# Altium project BLDC_Prototype.PrjPCB
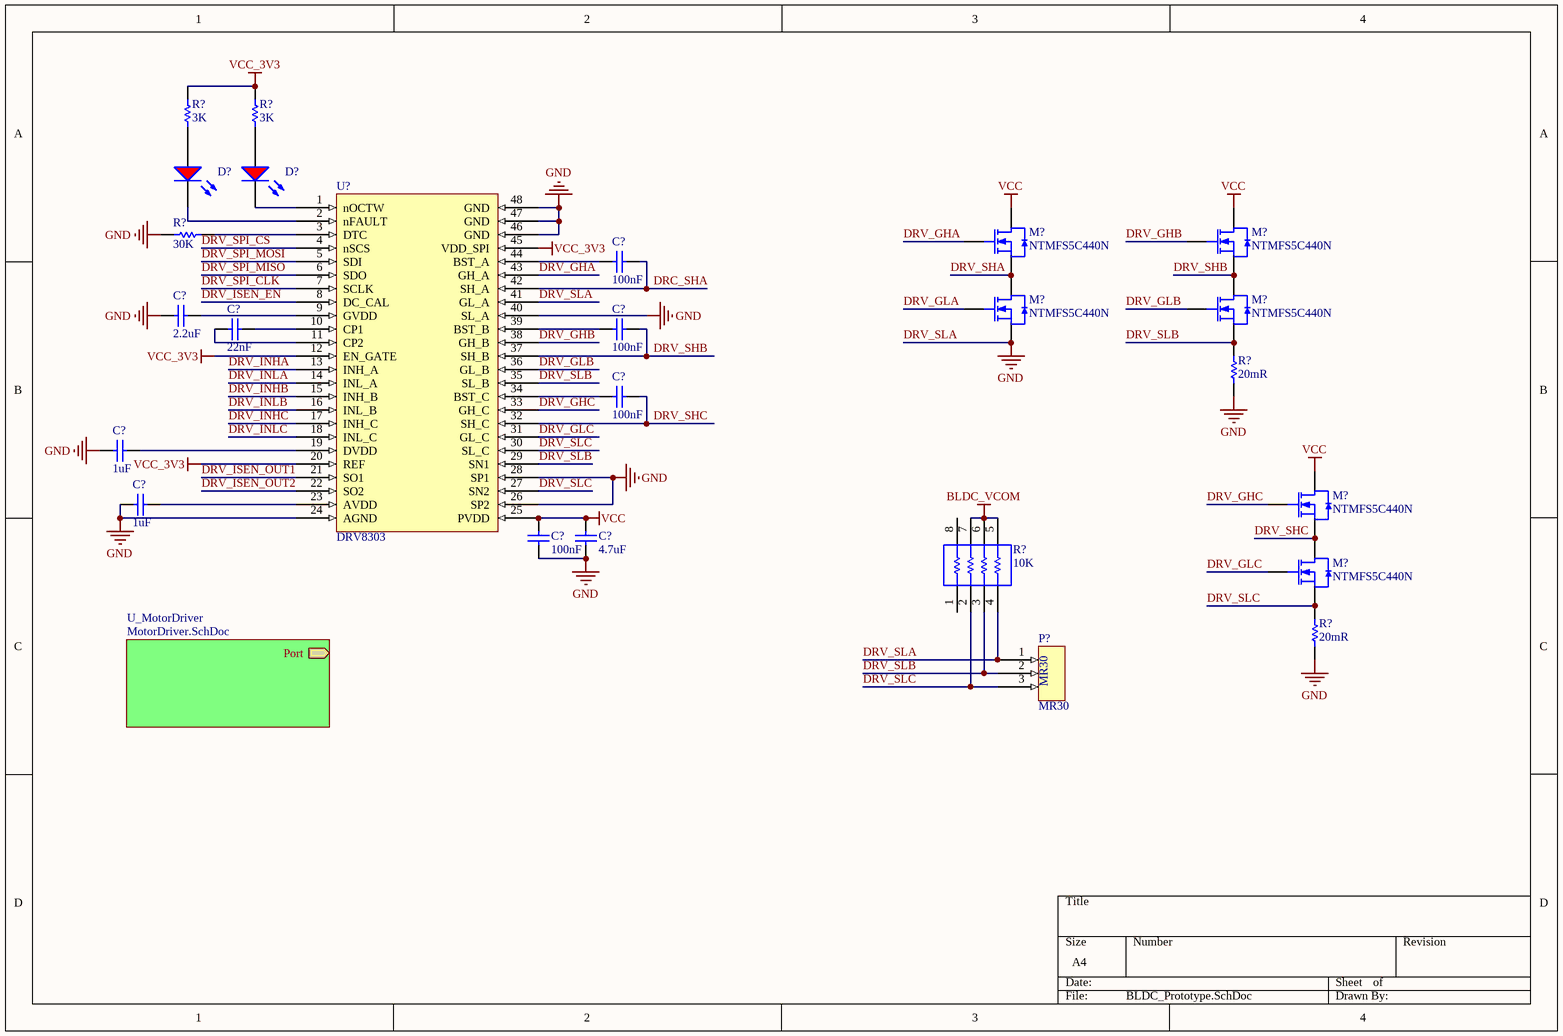
[diagram p0: BLDC_Prototype.SchDoc]
4 sheets, 79 parts. Net scope: hierarchical (ports join the sheet entries above them; power ports are global).
Board file: BLDC_Prototype.PcbDoc
Sheets:
  BLDC_Prototype.SchDoc
    U_MotorDriver = MotorDriver.SchDoc
  MCU.SchDoc
  MOSFET.SchDoc

## Sheet BLDC_Prototype.SchDoc
size A4

### Parts
(Parts that share a designator on the sheet are numbered #1, #2 ... from top to bottom, then left to right.)
C?#1  100nF  [SMC_0805]
C?#2  2.2uF  [SMC_0805]
C?#3  22nF  [SMC_0805]
C?#4  100nF  [SMC_0805]
C?#5  100nF  [SMC_0805]
C?#6  1uF  [SMC_0805]
C?#7  1uF  [SMC_0805]
C?#8  100nF  [SMC_0805]
C?#9  4.7uF  [SMC_0805]
D?#1  (no value)  [SMLED_0603]
D?#2  (no value)  [SMLED_0603]
M?#1  NTMFS5C440N  [PSON127P620X100-8N]
M?#2  NTMFS5C440N  [PSON127P620X100-8N]
M?#3  NTMFS5C440N  [PSON127P620X100-8N]
M?#4  NTMFS5C440N  [PSON127P620X100-8N]
M?#5  NTMFS5C440N  [PSON127P620X100-8N]
M?#6  NTMFS5C440N  [PSON127P620X100-8N]
P?  MR30  [MR30PW-FB]
R?#1  3K  [SMR_0805]
R?#2  3K  [SMR_0805]
R?#3  30K  [SMR_0805]
R?#4  20mR  [SMR_2512]
R?#5  10K  [SMR_0402x4]
R?#6  20mR  [SMR_2512]
U?#1  DRV8303  [TSSOP50P810X120_HS-49L]

### Sub-sheets
U_MotorDriver = MotorDriver.SchDoc: Port (out)

### Nets
BLDC_VCOM: R?#5.5 R?#5.6 R?#5.7
DRV_SLA: C?#2.1 C?#6.1 C?#7.1 C?#8.1 C?#9.1 M?#3.S P?.1 R?#3.1 R?#4.1 R?#5.4 R?#6.1 U?#1.24(AGND) U?#1.26(SP2) U?#1.28(SP1) U?#1.40(SL_A) U?#1.41(GL_A) U?#1.46(GND) U?#1.47(GND) U?#1.48(GND)  [also labelled GND]
VCC: C?#8.2 C?#9.2 M?#1.D M?#2.D M?#5.D U?#1.25(PVDD)
VCC_3V3: R?#1.1 R?#2.1 U?#1.12(EN_GATE) U?#1.20(REF) U?#1.45(VDD_SPI)
DRC_SHA: C?#1.2 U?#1.42(SH_A)
DRV_GHA: M?#1.G U?#1.43(GH_A)
DRV_GHB: M?#2.G U?#1.38(GH_B)
DRV_GHC: M?#5.G U?#1.33(GH_C)
DRV_GLA: M?#3.G
DRV_GLB: M?#4.G U?#1.36(GL_B)
DRV_GLC: M?#6.G U?#1.31(GL_C)
DRV_INHA: U?#1.13(INH_A)
DRV_INHB: U?#1.15(INH_B)
DRV_INHC: U?#1.17(INH_C)
DRV_INLA: U?#1.14(INL_A)
DRV_INLB: U?#1.16(INL_B)
DRV_INLC: U?#1.18(INL_C)
DRV_ISEN_EN: U?#1.8(DC_CAL)
DRV_ISEN_OUT1: U?#1.21(SO1)
DRV_ISEN_OUT2: U?#1.22(SO2)
DRV_SHA: M?#1.S M?#3.D
DRV_SHB: C?#4.2 M?#2.S M?#4.D U?#1.37(SH_B)
DRV_SHC: C?#5.2 M?#5.S M?#6.D U?#1.32(SH_C)
DRV_SLB: M?#4.S P?.2 R?#4.2 R?#5.3 U?#1.29(SN1) U?#1.35(SL_B)
DRV_SLC: M?#6.S P?.3 R?#5.2 R?#6.2 U?#1.27(SN2) U?#1.30(SL_C)
DRV_SPI_CLK: U?#1.7(SCLK)
DRV_SPI_CS: U?#1.4(nSCS)
DRV_SPI_MISO: U?#1.6(SDO)
DRV_SPI_MOSI: U?#1.5(SDI)
NetC?#1_1: C?#1.1 U?#1.44(BST_A)
NetC?#2_2: C?#2.2 U?#1.9(GVDD)
NetC?#3_1: C?#3.1 U?#1.11(CP2)
NetC?#3_2: C?#3.2 U?#1.10(CP1)
NetC?#4_1: C?#4.1 U?#1.39(BST_B)
NetC?#5_1: C?#5.1 U?#1.34(BST_C)
NetC?#6_2: C?#6.2 U?#1.19(DVDD)
NetC?#7_2: C?#7.2 U?#1.23(AVDD)
NetD?#1_A: D?#1.A R?#1.2
NetD?#1_K: D?#1.K U?#1.2(nFAULT)
NetD?#2_A: D?#2.A R?#2.2
NetD?#2_K: D?#2.K U?#1.1(nOCTW)
NetR?#3_2: R?#3.2 U?#1.3(DTC)

Not connected (* = marked no-connect by the designer): R?#5 1 8

### Library data of the parts
C?#1-C?#9 = Cap Ceramic
D?#1 D?#2 = LED_Red
R?#1-R?#4 R?#6 = Res SMT
R?#5 = Res Array x 4

## Sheet MotorDriver.SchDoc
size A4
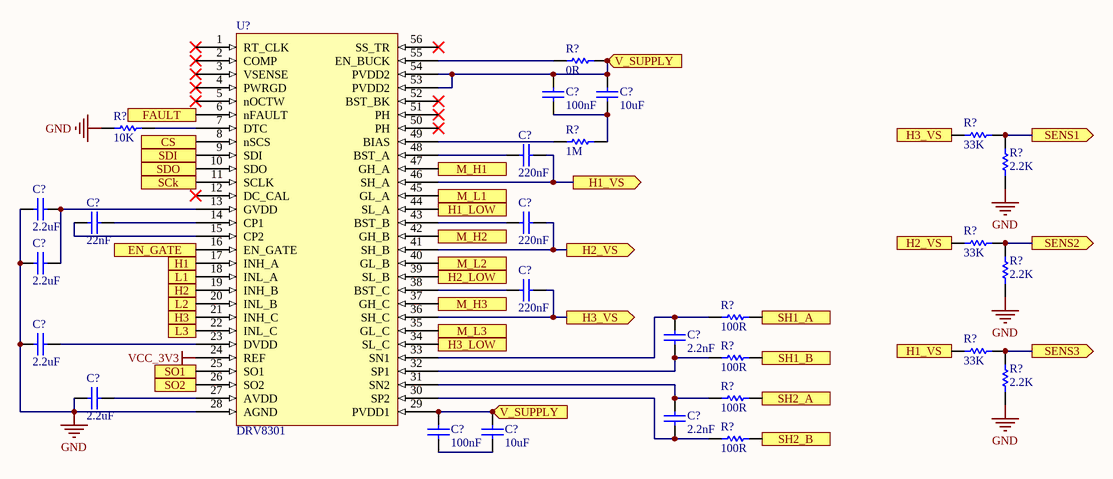
[diagram p1: MotorDriver.SchDoc]

### Parts
(Parts that share a designator on the sheet are numbered #1, #2 ... from top to bottom, then left to right.)
C?#10  100nF  [SMC_0805]
C?#11  10uF  [SMC_0805]
C?#12  220nF  [SMC_0805]
C?#13  2.2uF  [SMC_0805]
C?#14  22nF  [SMC_0805]
C?#15  220nF  [SMC_0805]
C?#16  2.2uF  [SMC_0805]
C?#17  220nF  [SMC_0805]
C?#18  2.2uF  [SMC_0805]
C?#19  2.2nF  [SMC_0402]
C?#20  2.2uF  [SMC_0805]
C?#21  2.2nF  [SMC_0402]
C?#22  100nF  [SMC_0805]
C?#23  10uF  [SMC_0805]
R?#7  0R  [SMR_0402]
R?#8  10K  [SMR_0402]
R?#9  33K  [SMR_0402]
R?#10  1M  [SMR_0402]
R?#11  2.2K  [SMR_0402]
R?#12  33K  [SMR_0402]
R?#13  2.2K  [SMR_0402]
R?#14  100R  [SMR_0402]
R?#15  33K  [SMR_0402]
R?#16  100R  [SMR_0402]
R?#17  100R  [SMR_0402]
R?#18  2.2K  [SMR_0402]
R?#19  100R  [SMR_0402]
U?#2  DRV8301  [TSSOP50P810X120_HS-57N]

### Ports
CS (in), EN_GATE (in), FAULT (out), H1 (in), H1_LOW (out), H1_VS (in), H1_VS (out), H2 (in), H2_LOW (out), H2_VS (in), H2_VS (out), H3 (in), H3_LOW (out), H3_VS (in), H3_VS (out), L1 (in), L2 (in), L3 (in), M_H1 (out), M_H2 (out), M_H3 (out), M_L1 (out), M_L2 (out), M_L3 (out), SCk (in), SDI (in), SDO (out), SENS1 (out), SENS2 (out), SENS3 (out), SH1_A (in), SH1_B (in), SH2_A (in), SH2_B (in), SO1 (out), SO2 (out), V_SUPPLY (in)

### Nets
GND: C?#13.2 C?#16.2 C?#18.2 C?#20.2 R?#8.1 R?#11.1 R?#13.1 R?#18.1 U?#2.28(AGND)  [project net DRV_SLA]
VCC_3V3: U?#2.24(REF)
NetC?#10_1: C?#10.1 C?#11.1 R?#10.2
NetC?#10_2: C?#10.2 C?#11.2 C?#22.2 C?#23.2 R?#7.2 U?#2.29(PVDD1) U?#2.53(PVDD2) U?#2.54(PVDD2) ; port V_SUPPLY
NetC?#12_1: C?#12.1 U?#2.48(BST_A)
NetC?#12_2: C?#12.2 R?#15.1 U?#2.46(SH_A) ; port H1_VS
NetC?#13_1: C?#13.1 C?#16.1 U?#2.13(GVDD)
NetC?#14_1: C?#14.1 U?#2.14(CP1)
NetC?#14_2: C?#14.2 U?#2.15(CP2)
NetC?#15_1: C?#15.1 U?#2.43(BST_B)
NetC?#15_2: C?#15.2 R?#12.1 U?#2.41(SH_B) ; port H2_VS
NetC?#17_1: C?#17.1 U?#2.38(BST_C)
NetC?#17_2: C?#17.2 R?#9.1 U?#2.36(SH_C) ; port H3_VS
NetC?#18_1: C?#18.1 U?#2.23(DVDD)
NetC?#19_1: C?#19.1 R?#16.1 U?#2.32(SP1)
NetC?#19_2: C?#19.2 R?#14.1 U?#2.33(SN1)
NetC?#20_1: C?#20.1 U?#2.27(AVDD)
NetC?#21_1: C?#21.1 R?#19.1 U?#2.30(SP2)
NetC?#21_2: C?#21.2 R?#17.1 U?#2.31(SN2)
NetC?#22_1: C?#22.1 C?#23.1
NetR?#7_1: R?#7.1 U?#2.55(EN_BUCK)
NetR?#8_2: R?#8.2 U?#2.7(DTC)
NetR?#9_2: R?#9.2 R?#11.2 ; port SENS1
NetR?#10_1: R?#10.1 U?#2.49(BIAS)
NetR?#12_2: R?#12.2 R?#13.2 ; port SENS2
NetR?#14_2: R?#14.2 ; port SH1_A
NetR?#15_2: R?#15.2 R?#18.2 ; port SENS3
NetR?#16_2: R?#16.2 ; port SH1_B
NetR?#17_2: R?#17.2 ; port SH2_A
NetR?#19_2: R?#19.2 ; port SH2_B
NetU?#2_6: U?#2.6(nFAULT) ; port FAULT
NetU?#2_8: U?#2.8(nSCS) ; port CS
NetU?#2_9: U?#2.9(SDI) ; port SDI
NetU?#2_10: U?#2.10(SDO) ; port SDO
NetU?#2_11: U?#2.11(SCLK) ; port SCk
NetU?#2_16: U?#2.16(EN_GATE) ; port EN_GATE
NetU?#2_17: U?#2.17(INH_A) ; port H1
NetU?#2_18: U?#2.18(INL_A) ; port L1
NetU?#2_19: U?#2.19(INH_B) ; port H2
NetU?#2_20: U?#2.20(INL_B) ; port L2
NetU?#2_21: U?#2.21(INH_C) ; port H3
NetU?#2_22: U?#2.22(INL_C) ; port L3
NetU?#2_25: U?#2.25(SO1) ; port SO1
NetU?#2_26: U?#2.26(SO2) ; port SO2
NetU?#2_34: U?#2.34(SL_C) ; port H3_LOW
NetU?#2_35: U?#2.35(GL_C) ; port M_L3
NetU?#2_37: U?#2.37(GH_C) ; port M_H3
NetU?#2_39: U?#2.39(SL_B) ; port H2_LOW
NetU?#2_40: U?#2.40(GL_B) ; port M_L2
NetU?#2_42: U?#2.42(GH_B) ; port M_H2
NetU?#2_44: U?#2.44(SL_A) ; port H1_LOW
NetU?#2_45: U?#2.45(GL_A) ; port M_L1
NetU?#2_47: U?#2.47(GH_A) ; port M_H1

Not connected (* = marked no-connect by the designer): U?#2 1(RT_CLK)* 2(COMP)* 3(VSENSE)* 4(PWRGD)* 5(nOCTW)* 12(DC_CAL)* 50(PH)* 51(PH)* 52(BST_BK)* 56(SS_TR)*

### Library data of the parts
C?#10-C?#23 = Cap Ceramic
R?#7-R?#19 = Res SMT

## Sheet MCU.SchDoc
size A4
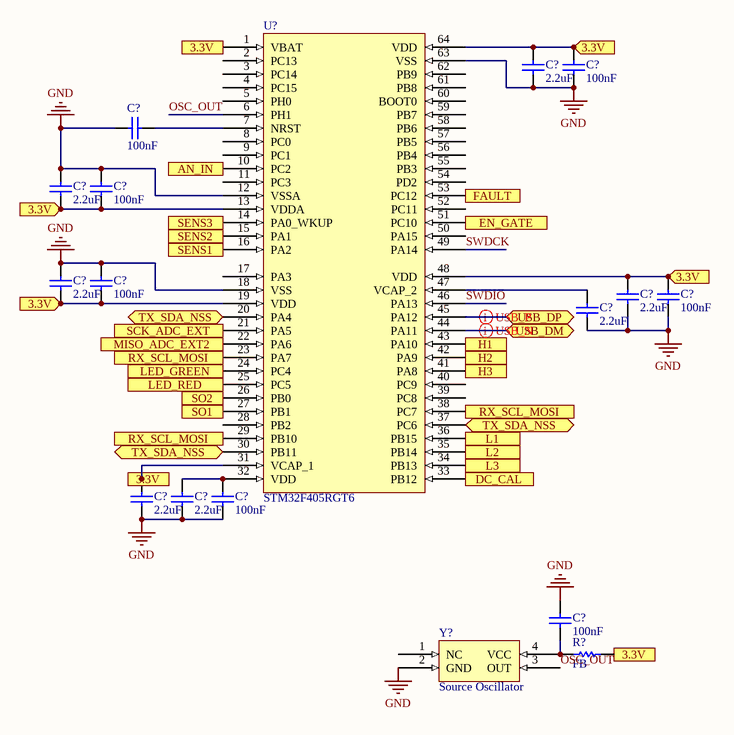
[diagram p2: MCU.SchDoc]

### Parts
(Parts that share a designator on the sheet are numbered #1, #2 ... from top to bottom, then left to right.)
C?#24  2.2uF  [SMC_0805]
C?#25  100nF  [SMC_0805]
C?#26  100nF  [SMC_0805]
C?#27  2.2uF  [SMC_0805]
C?#28  100nF  [SMC_0805]
C?#29  2.2uF  [SMC_0805]
C?#30  100nF  [SMC_0805]
C?#31  2.2uF  [SMC_0805]
C?#32  100nF  [SMC_0805]
C?#33  2.2uF  [SMC_0805]
C?#34  2.2uF  [SMC_0805]
C?#35  2.2uF  [SMC_0805]
C?#36  100nF  [SMC_0805]
C?#37  100nF  [SMC_0805]
R?#20  FB  [SMR_0805]
U?#3  STM32F405RGT6  [TSQFP50P1200X1200X160-64N]
Y?  Source Oscillator  [SMD_5032]

### Ports
3.3V (in), AN_IN (in), DC_CAL (in), EN_GATE (out), FAULT (in), H1 (out), H2 (out), H3 (out), L1 (out), L2 (out), L3 (out), LED_GREEN (out), LED_RED (out), MISO_ADC_EXT2 (in), RX_SCL_MOSI (in), RX_SCL_MOSI (out), SCK_ADC_EXT (in), SENS1 (in), SENS2 (in), SENS3 (in), SO1 (in), SO2 (in), TX_SDA_NSS (bidir), USB_DM (bidir), USB_DP (bidir)

### Nets
GND: C?#24.1 C?#25.1 C?#26.1 C?#27.2 C?#28.2 C?#29.2 C?#30.2 C?#31.1 C?#32.1 C?#33.1 C?#34.1 C?#35.1 C?#36.1 C?#37.2 U?#3.12(VSSA) U?#3.18(VSS) U?#3.63(VSS) Y?.2(GND)  [project net DRV_SLA]
OSC_OUT: U?#3.6(PH1) Y?.3(OUT)
SWDCK: U?#3.49(PA14)
SWDIO: U?#3.46(PA13)
NetC?#24_2: C?#24.2 C?#25.2 C?#27.1 C?#28.1 C?#29.1 C?#30.1 C?#31.2 C?#32.2 R?#20.2 U?#3.1(VBAT) U?#3.13(VDDA) U?#3.19(VDD) U?#3.48(VDD) U?#3.64(VDD) ; port 3.3V
NetC?#26_2: C?#26.2 U?#3.7(NRST)
NetC?#33_2: C?#33.2 U?#3.47(VCAP_2)
NetC?#34_2: C?#34.2 U?#3.31(VCAP_1)
NetC?#35_2: C?#35.2 C?#36.2 U?#3.32(VDD)
NetC?#37_1: C?#37.1 R?#20.1 Y?.4(VCC)
NetU?#3_10: U?#3.10(PC2) ; port AN_IN
NetU?#3_14: U?#3.14(PA0_WKUP) ; port SENS3
NetU?#3_15: U?#3.15(PA1) ; port SENS2
NetU?#3_16: U?#3.16(PA2) ; port SENS1
NetU?#3_20: U?#3.20(PA4) U?#3.30(PB11) U?#3.37(PC6) ; port TX_SDA_NSS
NetU?#3_21: U?#3.21(PA5) ; port SCK_ADC_EXT
NetU?#3_22: U?#3.22(PA6) ; port MISO_ADC_EXT2
NetU?#3_23: U?#3.23(PA7) U?#3.29(PB10) U?#3.38(PC7) ; port RX_SCL_MOSI
NetU?#3_24: U?#3.24(PC4) ; port LED_GREEN
NetU?#3_25: U?#3.25(PC5) ; port LED_RED
NetU?#3_26: U?#3.26(PB0) ; port SO2
NetU?#3_27: U?#3.27(PB1) ; port SO1
NetU?#3_33: U?#3.33(PB12) ; port DC_CAL
NetU?#3_34: U?#3.34(PB13) ; port L3
NetU?#3_35: U?#3.35(PB14) ; port L2
NetU?#3_36: U?#3.36(PB15) ; port L1
NetU?#3_41: U?#3.41(PA8) ; port H3
NetU?#3_42: U?#3.42(PA9) ; port H2
NetU?#3_43: U?#3.43(PA10) ; port H1
NetU?#3_44: U?#3.44(PA11) ; port USB_DM
NetU?#3_45: U?#3.45(PA12) ; port USB_DP
NetU?#3_51: U?#3.51(PC10) ; port EN_GATE
NetU?#3_53: U?#3.53(PC12) ; port FAULT

Not connected (* = marked no-connect by the designer): U?#3 2(PC13) 3(PC14) 4(PC15) 5(PH0) 8(PC0) 9(PC1) 11(PC3) 17(PA3) 28(PB2) 39(PC8) 40(PC9) 50(PA15) 52(PC11) 54(PD2) 55(PB3) 56(PB4) 57(PB5) 58(PB6) 59(PB7) 60(BOOT0) 61(PB8) 62(PB9); Y? 1(NC)

### Layout directives
differential pair: NetU?#3_44, NetU?#3_45

### Library data of the parts
C?#24-C?#37 = Cap Ceramic
R?#20 = Res SMT

## Sheet MOSFET.SchDoc
size A4
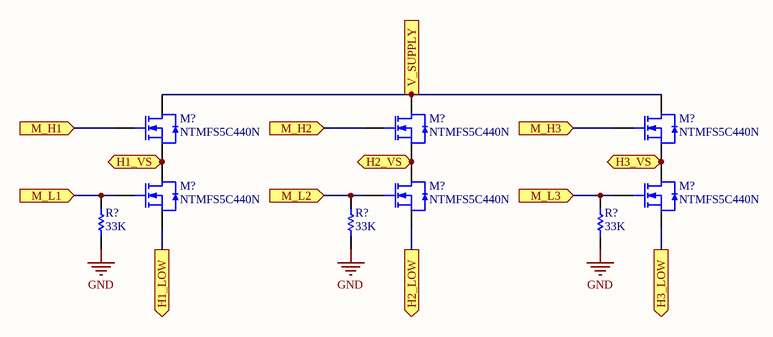
[diagram p3: MOSFET.SchDoc]

### Parts
(Parts that share a designator on the sheet are numbered #1, #2 ... from top to bottom, then left to right.)
M?#7  NTMFS5C440N  [PSON127P620X100-8N]
M?#8  NTMFS5C440N  [PSON127P620X100-8N]
M?#9  NTMFS5C440N  [PSON127P620X100-8N]
M?#10  NTMFS5C440N  [PSON127P620X100-8N]
M?#11  NTMFS5C440N  [PSON127P620X100-8N]
M?#12  NTMFS5C440N  [PSON127P620X100-8N]
R?#21  33K  [SMR_0402]
R?#22  33K  [SMR_0402]
R?#23  33K  [SMR_0402]

### Ports
H1_LOW (out), H1_VS (bidir), H2_LOW (out), H2_VS (bidir), H3_LOW (out), H3_VS (bidir), M_H1 (in), M_H2 (in), M_H3 (in), M_L1 (in), M_L2 (in), M_L3 (in), V_SUPPLY (in)

### Nets
GND: R?#21.1 R?#22.1 R?#23.1  [project net DRV_SLA]
NetM?#7_D: M?#7.D M?#8.D M?#9.D ; port V_SUPPLY
NetM?#7_G: M?#7.G ; port M_H1
NetM?#7_S: M?#7.S M?#10.D ; port H1_VS
NetM?#8_G: M?#8.G ; port M_H2
NetM?#8_S: M?#8.S M?#11.D ; port H2_VS
NetM?#9_G: M?#9.G ; port M_H3
NetM?#9_S: M?#9.S M?#12.D ; port H3_VS
NetM?#10_G: M?#10.G R?#21.2 ; port M_L1
NetM?#10_S: M?#10.S ; port H1_LOW
NetM?#11_G: M?#11.G R?#22.2 ; port M_L2
NetM?#11_S: M?#11.S ; port H2_LOW
NetM?#12_G: M?#12.G R?#23.2 ; port M_L3
NetM?#12_S: M?#12.S ; port H3_LOW

### Library data of the parts
R?#21-R?#23 = Res SMT

## Nets that join several sheets
DRV_SLA: BLDC_Prototype (19 pins), MotorDriver (9 pins), MCU (18 pins), MOSFET (R?#21.1 R?#22.1 R?#23.1)
VCC_3V3: BLDC_Prototype (5 pins), MotorDriver (U?#2.24)